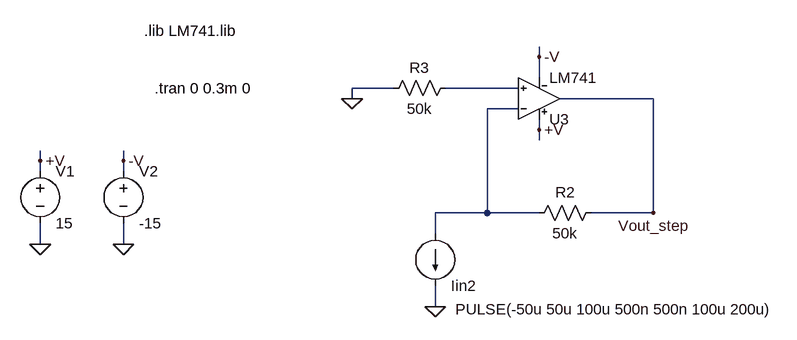
[diagram p0: schematic SlewRate_I2V.asc]
SlewRate_I2V.asc, the LTspice schematic file:
Version 4
SHEET 1 964 916
WIRE -528 304 -528 288
WIRE -528 336 -528 304
WIRE -752 352 -816 352
WIRE -560 352 -672 352
WIRE -816 368 -816 352
WIRE -352 368 -496 368
WIRE -560 384 -608 384
WIRE -528 416 -528 400
WIRE -528 432 -528 416
WIRE -1296 464 -1296 448
WIRE -1168 464 -1168 448
WIRE -1296 480 -1296 464
WIRE -1168 480 -1168 464
WIRE -608 544 -608 384
WIRE -608 544 -688 544
WIRE -528 544 -608 544
WIRE -352 544 -352 368
WIRE -352 544 -448 544
WIRE -688 576 -688 544
WIRE -1296 592 -1296 560
WIRE -1168 592 -1168 560
WIRE -688 688 -688 656
FLAG -1296 592 0
FLAG -1168 592 0
FLAG -1296 464 +V
FLAG -1168 464 -V
FLAG -352 544 Vout_step
FLAG -528 416 +V
FLAG -528 304 -V
FLAG -816 368 0
FLAG -688 688 0
DATAFLAG -352 448 ""
SYMBOL voltage -1296 464 R0
WINDOW 123 0 0 Left 2
WINDOW 39 0 0 Left 2
SYMATTR InstName V1
SYMATTR Value 15
SYMBOL voltage -1168 464 R0
WINDOW 123 0 0 Left 2
WINDOW 39 0 0 Left 2
SYMATTR InstName V2
SYMATTR Value -15
SYMBOL res -432 528 R90
WINDOW 0 0 56 VBottom 2
WINDOW 3 32 56 VTop 2
SYMATTR InstName R2
SYMATTR Value 50k
SYMBOL current -688 576 R0
WINDOW 0 24 80 Left 2
WINDOW 3 31 116 Left 2
WINDOW 123 24 28 Left 2
WINDOW 39 0 0 Left 0
SYMATTR InstName Iin2
SYMATTR Value PULSE(-50u 50u 100u 500n 500n 100u 200u)
SYMBOL LM741 -528 432 M180
SYMATTR InstName U3
SYMBOL res -656 336 R90
WINDOW 0 0 56 VBottom 2
WINDOW 3 32 56 VTop 2
SYMATTR InstName R3
SYMATTR Value 50k
TEXT -1120 352 Left 2 !.tran 0 0.3m 0
TEXT -1136 264 Left 2 !.lib LM741.lib

The netlist it stands for:
* SlewRate_I2V.asc
V1 +V 0 15
V2 -V 0 -15
R2 Vout_step N002 50k
Iin2 N002 0 PULSE(-50u 50u 100u 500n 500n 100u 200u)
XU3 N001 N002 +V -V Vout_step LM741  ; pins In+ In- V+ V- OUT
R3 N001 0 50k
.tran 0 0.3m 0
.lib LM741.lib
.lib LM741.lib
.backanno
.end